# Altium schematic sheet THS7002CPWP_Schematic.SchDoc
size A; SheetNumber: 2; SheetTotal: 4
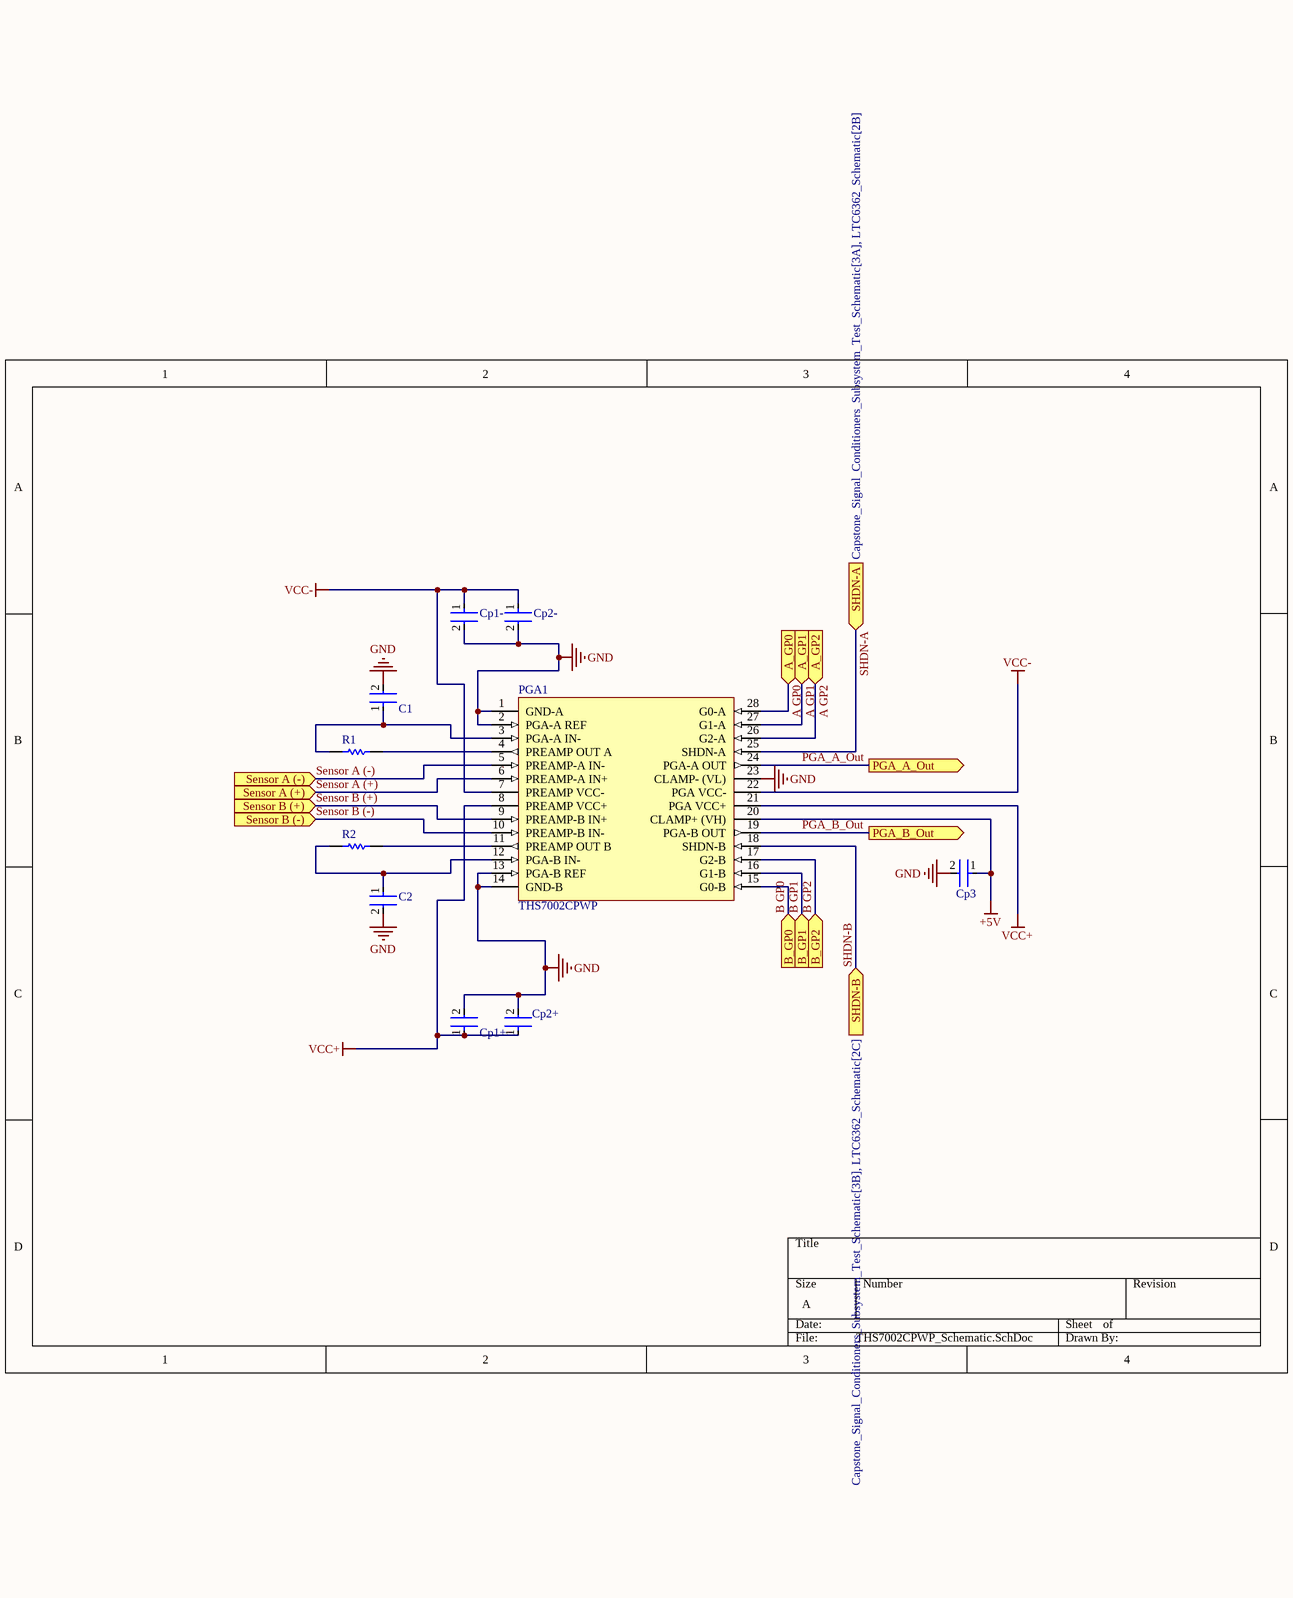
[diagram p0: THS7002CPWP_Schematic.SchDoc]

## Parts
C1  GRM3195C1H163JA01D  [FP-GRM319-0_15-IPC_A]  (value not drawn)
C2  GRM3195C1H163JA01D  [FP-GRM319-0_15-IPC_A]  (value not drawn)
Cp1+  CC0603KRX7R7BB104  [FP-CC0603-DA-MFG]  (value not drawn)
Cp1-  CC0603KRX7R7BB104  [FP-CC0603-DA-MFG]  (value not drawn)
Cp2+  C2012JB1A685K060AC  [FP-C2012-060-0_2-IPC_A]  (value not drawn)
Cp2-  C2012JB1A685K060AC  [FP-C2012-060-0_2-IPC_A]  (value not drawn)
Cp3  C2012JB1A685K060AC  [FP-C2012-060-0_2-IPC_A]  (value not drawn)
PGA1  THS7002CPWP  [PWP0028E_M]
R1  CRCW08050000Z0EA  [RESC2013X50X30LL20T20]  (value not drawn)
R2  CRCW08050000Z0EA  [RESC2013X50X30LL20T20]  (value not drawn)

## Ports
A_GP0 (in, see Capstone_Signal_Conditioners_Subsystem_Test_Schematic[2A]), A_GP1 (in, see Capstone_Signal_Conditioners_Subsystem_Test_Schematic[2A]), A_GP2 (in, see Capstone_Signal_Conditioners_Subsystem_Test_Schematic[3A]), B_GP0 (in, see Capstone_Signal_Conditioners_Subsystem_Test_Schematic[2B]), B_GP1 (in, see Capstone_Signal_Conditioners_Subsystem_Test_Schematic[2B]), B_GP2 (in, see Capstone_Signal_Conditioners_Subsystem_Test_Schematic[3B]), PGA_A_Out (out, see Capstone_Signal_Conditioners_Subsystem_Test_Schematic[3B], LTC6362_Schematic[1B]), PGA_B_Out (out, see Capstone_Signal_Conditioners_Subsystem_Test_Schematic[3B], LTC6362_Schematic[1B]), Sensor A (+) (in, see Capstone_Signal_Conditioners_Subsystem_Test_Schematic[2B]), Sensor A (-) (in, see Capstone_Signal_Conditioners_Subsystem_Test_Schematic[2B]), Sensor B (+) (in, see Capstone_Signal_Conditioners_Subsystem_Test_Schematic[2B]), Sensor B (-) (in, see Capstone_Signal_Conditioners_Subsystem_Test_Schematic[2B]), SHDN-A (in, see Capstone_Signal_Conditioners_Subsystem_Test_Schematic[3A], LTC6362_Schematic[2B]), SHDN-B (in, see Capstone_Signal_Conditioners_Subsystem_Test_Schematic[3B], LTC6362_Schematic[2C])

## Nets
+5V: Cp3.1 PGA1.20(CLAMP+_(VH))
GND: C1.2 C2.2 Cp1+.2 Cp1-.2 Cp2+.2 Cp2-.2 Cp3.2 PGA1.1(GND-A) PGA1.2(PGA-A_REF) PGA1.13(PGA-B_REF) PGA1.14(GND-B) PGA1.23(CLAMP-_(VL))
VCC+: Cp1+.1 Cp2+.1 PGA1.8(PREAMP_VCC+) PGA1.21(PGA_VCC+)
VCC-: Cp1-.1 Cp2-.1 PGA1.7(PREAMP_VCC-) PGA1.22(PGA_VCC-)
A GP0: PGA1.28(G0-A) ; port A_GP0
A GP1: PGA1.27(G1-A) ; port A_GP1
A GP2: PGA1.26(G2-A) ; port A_GP2
B GP0: PGA1.15(G0-B) ; port B_GP0
B GP1: PGA1.16(G1-B) ; port B_GP1
B GP2: PGA1.17(G2-B) ; port B_GP2
PGA_A_Out: PGA1.24(PGA-A_OUT) ; port PGA_A_Out
PGA_B_Out: PGA1.19(PGA-B_OUT) ; port PGA_B_Out
Sensor A (+): PGA1.6(PREAMP-A_IN+) ; port Sensor A (+)
Sensor A (-): PGA1.5(PREAMP-A_IN-) ; port Sensor A (-)
Sensor B (+): PGA1.9(PREAMP-B_IN+) ; port Sensor B (+)
Sensor B (-): PGA1.10(PREAMP-B_IN-) ; port Sensor B (-)
SHDN-A: PGA1.25(SHDN-A) ; port SHDN-A
SHDN-B: PGA1.18(SHDN-B) ; port SHDN-B
NetC1_1: C1.1 PGA1.3(PGA-A_IN-) R1.1
NetC2_1: C2.1 PGA1.12(PGA-B_IN-) R2.1
NetPGA1_4: PGA1.4(PREAMP_OUT_A) R1.2
NetPGA1_11: PGA1.11(PREAMP_OUT_B) R2.2

## Library data of the parts
C1 C2 = CMP-06035-007665-1: Chip Multilayer Ceramic Capacitors for General Purpose, 1206, 16000pF, C0G, 30ppm/°C, 5%, 50V; Capacitance: 16nF; Tolerance: 5%; Case Code (Metric): 3216; Length: 3.2mm; Package Quantity: 4000; Mount: Surface Mount; Voltage Rating (DC): 50V; Voltage Rating: 50V; Case Code (Imperial): 1206; Height: 0.85mm; Min Operating Temperature: -55°C; Max Operating Temperature: 125°C; Termination: SMD/SMT; Width: 0.063inch; Radiation Hardening: No; Depth: 1.6mm; Thickness: 0.037inch; Dielectric: C0G; Case/Package: 1206; Packaging: Tape and Reel
Cp1+ Cp1- = CMP-2000-05002-2: CAP CER 0.1UF 16V X7R 0603; Manufacturer: YAGEO; Tolerance: 0.1; Value: 100 nF; Temperature Coefficient: 15%; Description: CC0603 100 nF X7R 10.00% 16 V; Voltage Rating: 16 V; Package: CC0603-DA; ComponentLink2Description: Datasheet; Octopart: https://octopart.com/cc0603krx7r7bb104-yageo-192941; Temperature Range High: +125°C; Digikey Description: CAP CER 0.1UF 16V X7R 0603; Voltage: 16 V; Device Class L2: Capacitors; Height: 0.9mm; Temperature: -55°C to +125°C; Manufacturer Part Number: CC0603KRX7R7BB104; Device Class L1: Passive Components; Device Class L3: Ceramic Capacitors; ComponentLink2URL: http://www.yageo.com/documents/recent/UPY-GPHC_X7R_6.3V-to-50V_18.pdf; Footprint Url: http://www.yageo.com/exep/pages/download/literatures/UPY-C_GEN_24.pdf; RoHS: TRUE; Temperature Range Low: -55°C; Temperature Characteristic: X7R; Lead Free: Yes; Capacitance: 100 nF; Category: Cap; Mouser Description: Multilayer Ceramic Capacitor, CC Series, 0.1 - F, - 10%, X7R, 16 V, 0603 [1608 Metric]; Material: Ceramic; Automotive: No
Cp2+ Cp2- Cp3 = CMP-08246-004641-1: Multilayer Ceramic Capacitors 6.8μF ±10% 10V JB SMD 0805; Capacitance: 6.8uF; RoHS Compliant: Yes; Case Code (Metric): 5032; Case/Package: 0805; Voltage Rating: 10V; Width: 0.049inch; Min Operating Temperature: -25°C; Mount: Surface Mount; Voltage Rating (DC): 10V; Dielectric Material: Ceramic; Case Code (Imperial): 2012; Package Quantity: 4000; Lead Free: Lead Free; Packaging: Tape and Reel; Length: 0.079inch; Tolerance: 10%; Thickness: 0.028inch; Max Operating Temperature: 85°C; Series: C
PGA1 = CMP-0988-00132-2: 70-MHz High-Speed Programmable-Gain Amplifier, Dual, 0 to 70 degC, 28-pin SOP (PWP28), Green (RoHS & no Sb/Br); Manufacturer: Texas Instruments; Disable: TRUE; BW @ Acl(MHz): 100; Vs(Min)(V): 9; Vs(Max)(V): 32; Number of Channels: 2; Vio(Max)(mV): 7; Iib(Max)(nA): 6000; SubFamily: Variable Gain Amplifier; Vn at Flatband(Typ)(nV/rtHz): 1.7; Slew Rate(Typ)(V/us): 85; ComponentLink1Description: Manufacturer URL; Code_JEDEC: MO-153; PackageVersion: 4073225-6/I, 05/2011; PackageReference: PWP0028E; Eco-Plan: Green (RoHS & no Sb/Br); ComponentLink2URL: http://www.ti.com/general/docs/lit/getliterature.tsp?genericPartNumber=THS7002&fileType=pdf; PackageDescription: 28-Pin Plastic Small Outline, Body 4.4 x 9.7 mm, Pitch 0.65 mm; DatasheetVersion: SLOS214C; ComponentLink3URL: http://www.ti.com/litv/pdf/mpds373; ComponentLink3Description: Package Specification; ComponentLink1URL: http://www.ti.com/; ComponentLink2Description: Datasheet; Mounting Technology: Surface Mount; PartNumber: THS7002CPWP
R1 R2 = CMP-2001-04896-1: Manufacturer: Vishay Dale; Part Number: CRCW08050000Z0EA